# Altium project Project.PrjPcb
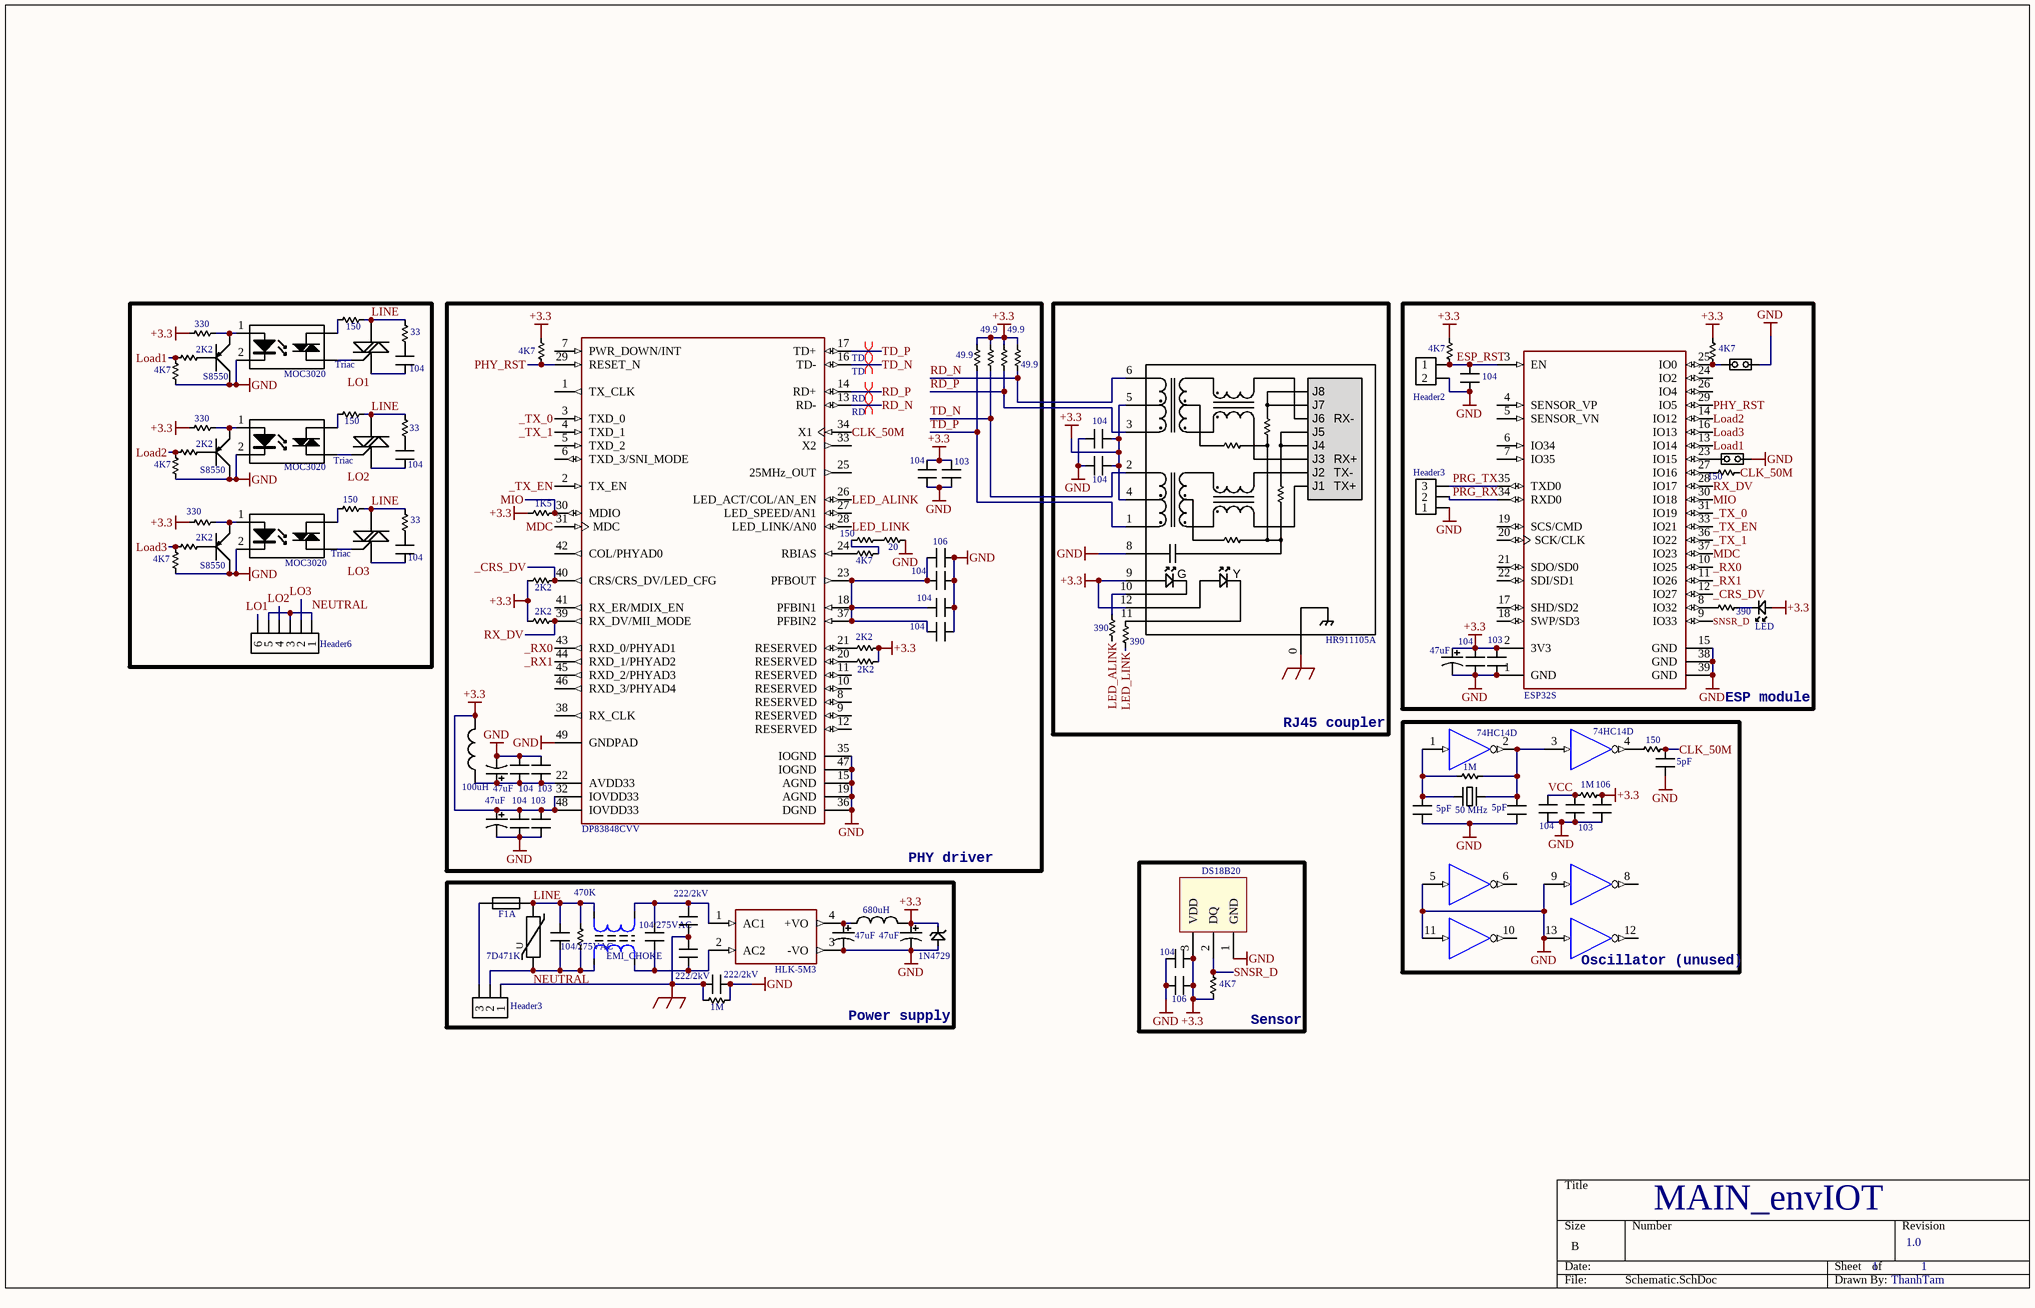
[diagram p0: Schematic.SchDoc]
1 sheet, 105 parts. Net scope: global (net labels, ports and power ports of the same name join across sheets).
Board file: PCB.PcbDoc

## Sheet Schematic.SchDoc
size B

### Parts
C1  104  [CAP0805]
C2  104  [CAP0805]
C3  104  [CAP0805]
C4  106  [CAP0805]
C5  104  [CAP0805]
C6  104  [CAP0805]
C7  104  [CAP0805]
C8  47uF  [CAP-ELECT-SMD-5X5.4]
C9  104  [CAP0805]
C10  103  [CAP0805]
C11  5pF  [CAP0603]
C12  47uF  [CAP-ELECT-SMD-5X5.4]
C13  104  [CAP0805]
C14  103  [CAP0805]
C15  5pF  [CAP0603]
C16  5pF  [CAP0603]
C17  104  [CAP0805]
C18  103  [CAP0805]
C19  103  [CAP0805]
C20  47uF  [CAP-ELECT-SMD-5X5.4]
C21  104  [CAP0805]
C22  104/275VAC  [CAP60]
C23  104/275VAC  [CAP60]
C24  222/2kV  [CAP25]
C25  47uF  [CAP-ELECT-SMD-5X5.4]
C26  47uF  [CAP-ELECT-SMD-5X5.4]
C27  104  [CAP0805]
C28  222/2kV  [CAP25]
C29  106  [CAP0805]
C30  106  [CAP0805]
C31  222/2kV  [CAP25]
C32  104  [CAP0805]
C33  103  [CAP0805]
C34  104  [CAP40]
C35  104  [CAP40]
C36  104  [CAP40]
DZ1  1N4729  [DIO_DZ1W]
F1  F1A  [FUSE-SOCKET]
IC1  DP83848CVV  [TQFP48_T]
IC2  74HC14D  [SO14]  (parts A,B,C,D,E,F of 6)
IC3  DS18B20  [HDR3]
IC4  MOC3020  [DIP6]
IC5  MOC3020  [DIP6]
IC6  MOC3020  [DIP6]
J1  Jumper2  [J2_SM]  (value not drawn)
J2  Header6  [KF142-5.08-6-V]
J3  Header2  [HDR2]
J4  Header3  [J3_SM]
J5  HR911105A  [HR911105A]
J6  Header3  [KF142-5.08-3-V]
J10  Jumper2  [J2_SM]  (value not drawn)
L1  680uH  [4D28]
L2  100uH  [CD32]
L3  EMI_CHOKE  [IND_UU9.8]
LED1  LED  [HDR2]
M1  ESP32S  [ESP32S]
M2  HLK-5M3  [HLK-5M]
MOV1  7D471K  [MOV_7D]
Q1  S8550  [SOT23-123]
Q2  S8550  [SOT23-123]
Q3  S8550  [SOT23-123]
R1  49.9  [RES0805]
R2  49.9  [RES0805]
R3  4K7  [RES0805]
R4  4K7  [RES0805]
R5  4K7  [RES0805]
R6  49.9  [RES0805]
R7  49.9  [RES0805]
R8  390  [RES0805]
R9  150  [RES0805]
R10  150  [RES0805]
R11  20  [RES0805]
R12  4K7  [RES0805]
R13  2K2  [RES0805]
R14  2K2  [RES0805]
R15  390  [RES0805]
R16  2K2  [RES0805]
R17  390  [RES0805]
R18  2K2  [RES0805]
R19  150  [RES0805]
R20  1M  [RES0805]
R21  470K  [RES35]
R22  4K7  [RES0805]
R23  1M  [RES0805]
R24  1M  [RES0805]
R25  33  [RES35]
R26  150  [RES35]
R27  330  [RES0805]
R28  2K2  [RES0805]
R29  4K7  [RES0805]
R30  33  [RES35]
R31  150  [RES35]
R32  330  [RES0805]
R33  2K2  [RES0805]
R34  4K7  [RES0805]
R35  33  [RES35]
R36  150  [RES35]
R37  330  [RES0805]
R38  2K2  [RES0805]
R39  4K7  [RES0805]
R40  1K5  [RES0805]
T1  Triac  [TO-220]
T2  Triac  [TO-220]
T3  Triac  [TO-220]
XT1  50 MHz  [XTAL_3225]

### Blocks framed on the sheet
PHY driver: C4-C7 C12-C14 C19-C21 C32 C33 IC1 L2 R1 R2 R5-R7 R10-R14 R16 R18 R40
RJ45 coupler: C2 C3 J5 R15 R17
ESP module: C1 C8-C10 J1 J3 J4 J10 LED1 M1 R3 R4 R8 R9
Oscillator (unused): C11 C15-C18 C30 IC2 R19 R20 R23 XT1
Power supply: C22-C26 C28 C31 DZ1 F1 J6 L1 L3 M2 MOV1 R21 R24
Sensor: C27 C29 IC3 R22

### Nets
+3.3: C2.1 C3.1 C8.1 C9.2 C10.2 C19.2 C20.1 C21.2 C25.1 C27.2 C29.2 C30.1 C32.1 C33.1 DZ1.2(K) IC1.32(IOVDD33) IC1.48(IOVDD33) IC3.3(VDD) J5.4 J5.5 J5.9 J5.12 L1.1 L2.2 LED1.1(A) M1.2(3V3) R1.1 R2.1 R3.2 R4.2 R5.2 R6.1 R7.1 R13.2 R14.2 R16.1 R18.1 R22.1 R23.1 R27.1 R32.1 R37.1 R40.2
CHAS: C24.1 C28.2 C31.1 J5.0(SHIELD) J6.1 R24.1
GND: C1.1 C2.2 C3.2 C4.1 C5.1 C6.1 C7.1 C8.2 C9.1 C10.1 C11.2 C12.2 C13.1 C14.1 C15.2 C16.2 C17.2 C18.2 C19.1 C20.2 C21.1 C25.2 C26.2 C27.1 C29.1 C30.2 C31.2 C32.2 C33.2 DZ1.1(A) IC1.15(AGND) IC1.19(AGND) IC1.35(IOGND) IC1.36(DGND) IC1.47(IOGND) IC1.49(GNDPAD) IC2.5(A) IC2.7(GND) IC2.9(A) IC2.11(A) IC2.13(A) IC3.1(GND) IC4.2(K) IC5.2(K) IC6.2(K) J1.1 J3.2 J4.1 J5.8 J10.2 M1.1(GND) M1.15(GND) M1.38(GND) M1.39(GND) M2.3(-VO) Q1.2(C) Q2.2(C) Q3.2(C) R11.1 R24.2 R29.2 R34.2 R39.2
VCC: C17.1 C18.1 IC2.14(VCC) R23.2
_CRS_DV: IC1.40(CRS/CRS_DV/LED_CFG) M1.12(IO27) R13.1
_RX0: IC1.43(RXD_0/PHYAD1) M1.10(IO25)
_RX1: IC1.44(RXD_1/PHYAD2) M1.11(IO26)
_TX_0: IC1.3(TXD_0) M1.31(IO19)
_TX_1: IC1.4(TXD_1) M1.36(IO22)
_TX_EN: IC1.2(TX_EN) M1.33(IO21)
CLK_50M: C11.1 IC1.34(X1) R9.1 R19.1
ESP_RST: C1.2 J3.1 M1.3(EN) R4.1
LED_ALINK: IC1.26(LED_ACT/COL/AN_EN) R15.2
LED_LINK: IC1.28(LED_LINK/AN0) R17.2
LINE: C22.2 F1.2 L3.4 MOV1.2 R21.2 R25.1 R26.2 R30.1 R31.2 R35.1 R36.2 T1.2(T2) T2.2(T2) T3.2(T2)
LO1: C34.1 J2.6 T1.1(T2)
LO2: C35.1 J2.4 T2.1(T2)
LO3: C36.1 J2.2 T3.1(T2)
Load1: M1.13(IO14) R28.2 R29.1
Load2: M1.14(IO12) R33.2 R34.1
Load3: M1.16(IO13) R38.2 R39.1
MDC: IC1.31(MDC) M1.37(IO23)
MIO: IC1.30(MDIO) M1.30(IO18) R40.1
NEUTRAL: C22.1 J2.1 J2.3 J2.5 J6.2 L3.1 MOV1.1 R21.1
PHY_RST: IC1.29(RESET_N) M1.29(IO5) R5.1
PRG_RX: J4.2 M1.34(RXD0)
PRG_TX: J4.3 M1.35(TXD0)
RD_N: IC1.13(RD-) J5.6 R7.2
RD_P: IC1.14(RD+) J5.3 R2.2
RX_DV: IC1.39(RX_DV/MII_MODE) M1.28(IO17) R14.1
SNSR_D: IC3.2(DQ) M1.9(IO33) R22.2
TD_N: IC1.16(TD-) J5.2 R1.2
TD_P: IC1.17(TD+) J5.1 R6.2
NetC4_2: C4.2 C5.2 C6.2 C7.2 IC1.18(PFBIN1) IC1.23(PFBOUT) IC1.37(PFBIN2)
NetC12_1: C12.1 C13.2 C14.2 IC1.22(AVDD33) L2.1
NetC15_1: C15.1 IC2.1(A) R20.2 XT1.1
NetC16_1: C16.1 IC2.2(Y) IC2.3(A) R20.1 XT1.2
NetC23_1: C23.1 C28.1 L3.2 M2.2(AC2)
NetC23_2: C23.2 C24.2 L3.3 M2.1(AC1)
NetC26_1: C26.1 L1.2 M2.4(+VO)
NetC34_2: C34.2 R25.2
NetC35_2: C35.2 R30.2
NetC36_2: C36.2 R35.2
NetF1_1: F1.1 J6.3
NetIC1_20: IC1.20(RESERVED) R18.2
NetIC1_21: IC1.21(RESERVED) R16.2
NetIC1_24: IC1.24(RBIAS) R12.2
NetIC2_4: IC2.4(Y) R19.2
NetIC4_1: IC4.1(A) Q1.3(E) R27.2
NetIC4_4: IC4.4(A2) T1.3(G)
NetIC4_6: IC4.6(A1) R26.1
NetIC5_1: IC5.1(A) Q2.3(E) R32.2
NetIC5_4: IC5.4(A2) T2.3(G)
NetIC5_6: IC5.6(A1) R31.1
NetIC6_1: IC6.1(A) Q3.3(E) R37.2
NetIC6_4: IC6.4(A2) T3.3(G)
NetIC6_6: IC6.6(A1) R36.1
NetJ1_2: J1.2 M1.25(IO0) R3.1
NetJ5_10: J5.10 R15.1
NetJ5_11: J5.11 R17.1
NetJ10_1: J10.1 M1.23(IO15)
NetLED1_2: LED1.2(K) R8.2
NetM1_8: M1.8(IO32) R8.1
NetM1_27: M1.27(IO16) R9.2
NetQ1_1: Q1.1(B) R28.1
NetQ2_1: Q2.1(B) R33.1
NetQ3_1: Q3.1(B) R38.1
NetR10_1: R10.1 R11.2
NetR10_2: R10.2 R12.1

Not connected (* = marked no-connect by the designer): IC1 1(TX_CLK) 5(TXD_2) 6(TXD_3/SNI_MODE) 7(PWR_DOWN/INT) 8(RESERVED) 9(RESERVED) 10(RESERVED) 11(RESERVED) 12(RESERVED) 25(25MHz_OUT) 27(LED_SPEED/AN1) 33(X2) 38(RX_CLK) 41(RX_ER/MDIX_EN) 42(COL/PHYAD0) 45(RXD_2/PHYAD3) 46(RXD_3/PHYAD4); IC2 6(Y) 8(Y) 10(Y) 12(Y); M1 4(SENSOR_VP) 5(SENSOR_VN) 6(IO34) 7(IO35) 17(SHD/SD2) 18(SWP/SD3) 19(SCS/CMD) 20(SCK/CLK) 21(SDO/SD0) 22(SDI/SD1) 24(IO2) 26(IO4)

### Layout directives
differential pair; differential pair class TD: TD_N, TD_P
differential pair; differential pair class RD: RD_N, RD_P

### Notes on the sheet
- MAIN_envIOT
- 1.0
- 1
- ThanhTam
- (in symbol HR911105A) J8; J7; J6; RX-; J4; J3; RX+; J2; TX-; J1; TX+; G; Y
- (in symbol MOV) U

### Library data of the parts
C1-C7 C9-C11 C13-C19 C21-C24 C27-C36 = CAP
C8 C12 C20 C25 C26 = CAP-POL
DZ1 = Zener
F1 = Fuse
IC1 = DP83848CVV: PHYTER® Commercial Temperature Single Port 10/100 Mb/s Ethernet Physical Layer Transceiver, 48-pin LQFP, Pb-Free, 250 Tray; PartNumber: DP83848CVV/NOPB; Manufacturer: Texas Instruments; PackageTopMarking: NSUZXYTT*DP83848VV*VBC; High-Reliability: Y; PowerWise: N; CompType: Interface IC; ComponentLink1Description: Datasheet URL; PinCount: 48; ComponentLink1URL: http://www.ti.com/general/docs/lit/getliterature.tsp?genericPartNumber=DP83848C&fileType=pdf; PackageDescription: LQFP, 7 x 7 x 1.4mm, 48 Lead, 0.5mm Pitch; RoHS: Y; PackageReference: PT0048A
IC2 = SN74HC14N: Hex Schmitt-Trigger Inverter; Published: 8-Jun-2000; LatestRevisionDate: 04-Mar-2005; LatestRevisionNote: Stylized 3D Model Added.; DatasheetVersion: May-1997; PackageVersion: Oct-1995; PackageReference: N014; Publisher: Altium Limited; PackageDescription: DIP; 14 Leads; Row Spacing 7.62 mm; Pitch 2.54 mm; ComponentLink1Description: Manufacturer Link; ComponentLink1URL: http://www.ti.com/; ComponentLink2Description: Datasheet; ComponentLink2URL: http://www-s.ti.com/sc/ds/sn74hc14.pdf
IC3 = DS18S20: High Precision  1-Wire® Digital Thermometer
J1 J10 = Jumper2: Manufacturer: W¨¹rth Elektronik eiSos GmbH; partNo: 613002143121; ComponentLink1 Description: Manufacturer; ComponentLink2 Description: Datasheet; NoPins: 02; Created Date: 29 March 2013; ComponentLink1URL: http://www.we-online.com; ComponentLink2URL: http://katalog.we-online.de/em/datasheet/6130xx143121.pdf; Created by: Karrer Zheng
J3 = Header2: SYS_RST; Manufacturer: W¨¹rth Elektronik eiSos GmbH; partNo: 613002143121; ComponentLink1 Description: Manufacturer; ComponentLink2 Description: Datasheet; NoPins: 02; Created Date: 29 March 2013; ComponentLink1URL: http://www.we-online.com; ComponentLink2URL: http://katalog.we-online.de/em/datasheet/6130xx143121.pdf; Created by: Karrer Zheng
J4 = Header3: PROG
J6 = Header3: Power
L1 L2 = Inductor
LED1 = LED: Code - JEDEC: DO-214-AB; Value: 1N5007; Published: 8-Jun-2000; Revision: July-2002: Re-released for DXP Platform.; Publisher: Altium Limited
M2 = HLK-5M
MOV1 = MOV
Q1-Q3 = BJT_PNP
R1-R40 = RES
XT1 = XTAL